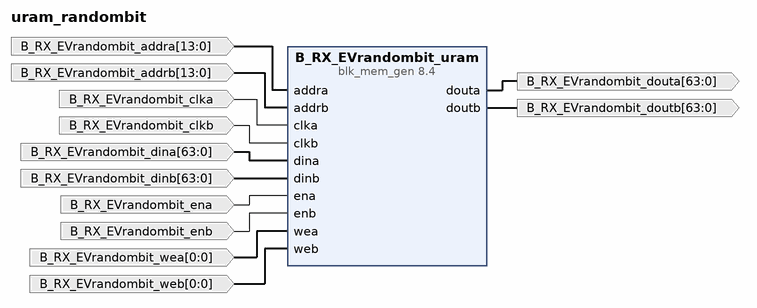
[diagram p0: block diagram of the top level]
# Vivado block design uram_randombit, xcku5p-ffvb676-2-e, Vivado 2022.1
create_bd_design uram_randombit

create_bd_port -dir I -from 13 -to 0 B_RX_EVrandombit_addra
create_bd_port -dir I -from 63 -to 0 B_RX_EVrandombit_dina
create_bd_port -dir I -type clk B_RX_EVrandombit_clka
create_bd_port -dir I B_RX_EVrandombit_ena
create_bd_port -dir O -from 63 -to 0 B_RX_EVrandombit_douta
create_bd_port -dir I -from 0 -to 0 B_RX_EVrandombit_wea
create_bd_port -dir I B_RX_EVrandombit_enb
create_bd_port -dir I -type clk B_RX_EVrandombit_clkb
create_bd_port -dir I -from 13 -to 0 B_RX_EVrandombit_addrb
create_bd_port -dir O -from 63 -to 0 B_RX_EVrandombit_doutb
create_bd_port -dir I -from 63 -to 0 B_RX_EVrandombit_dinb
create_bd_port -dir I -from 0 -to 0 B_RX_EVrandombit_web

create_bd_cell -type ip -vlnv xilinx.com:ip:blk_mem_gen:8.4 B_RX_EVrandombit_uram
set_property -dict [list \
  CONFIG.Assume_Synchronous_Clk true \
  CONFIG.Enable_32bit_Address false \
  CONFIG.Enable_B Use_ENB_Pin \
  CONFIG.Memory_Type True_Dual_Port_RAM \
  CONFIG.Operating_Mode_A NO_CHANGE \
  CONFIG.Operating_Mode_B NO_CHANGE \
  CONFIG.PRIM_type_to_Implement BRAM \
  CONFIG.Port_B_Clock 100 \
  CONFIG.Port_B_Enable_Rate 100 \
  CONFIG.Port_B_Write_Rate 50 \
  CONFIG.Read_Width_A 64 \
  CONFIG.Read_Width_B 64 \
  CONFIG.Register_PortA_Output_of_Memory_Primitives true \
  CONFIG.Register_PortB_Output_of_Memory_Primitives true \
  CONFIG.Use_Byte_Write_Enable false \
  CONFIG.Use_RSTA_Pin false \
  CONFIG.Write_Depth_A 16384 \
  CONFIG.Write_Width_A 64 \
  CONFIG.Write_Width_B 64 \
  CONFIG.use_bram_block Stand_Alone \
] [get_bd_cells B_RX_EVrandombit_uram]

# ---- connections ----

connect_bd_net [get_bd_pins B_RX_EVrandombit_uram/douta] [get_bd_ports B_RX_EVrandombit_douta]
connect_bd_net [get_bd_pins B_RX_EVrandombit_uram/doutb] [get_bd_ports B_RX_EVrandombit_doutb]
connect_bd_net -net addra_0_1 [get_bd_ports B_RX_EVrandombit_addra] [get_bd_pins B_RX_EVrandombit_uram/addra]
connect_bd_net -net addrb_0_1 [get_bd_ports B_RX_EVrandombit_addrb] [get_bd_pins B_RX_EVrandombit_uram/addrb]
connect_bd_net -net clka_0_1 [get_bd_ports B_RX_EVrandombit_clka] [get_bd_pins B_RX_EVrandombit_uram/clka]
connect_bd_net -net clkb_0_1 [get_bd_ports B_RX_EVrandombit_clkb] [get_bd_pins B_RX_EVrandombit_uram/clkb]
connect_bd_net -net dina_0_1 [get_bd_ports B_RX_EVrandombit_dina] [get_bd_pins B_RX_EVrandombit_uram/dina]
connect_bd_net -net dinb_0_1 [get_bd_ports B_RX_EVrandombit_dinb] [get_bd_pins B_RX_EVrandombit_uram/dinb]
connect_bd_net -net ena_0_1 [get_bd_ports B_RX_EVrandombit_ena] [get_bd_pins B_RX_EVrandombit_uram/ena]
connect_bd_net -net enb_0_1 [get_bd_ports B_RX_EVrandombit_enb] [get_bd_pins B_RX_EVrandombit_uram/enb]
connect_bd_net -net wea_0_1 [get_bd_ports B_RX_EVrandombit_wea] [get_bd_pins B_RX_EVrandombit_uram/wea]
connect_bd_net -net web_0_1 [get_bd_ports B_RX_EVrandombit_web] [get_bd_pins B_RX_EVrandombit_uram/web]

validate_bd_design
save_bd_design
